# EAGLE design ArduinoAirQuailtyTop (EAGLE 7.4.0)
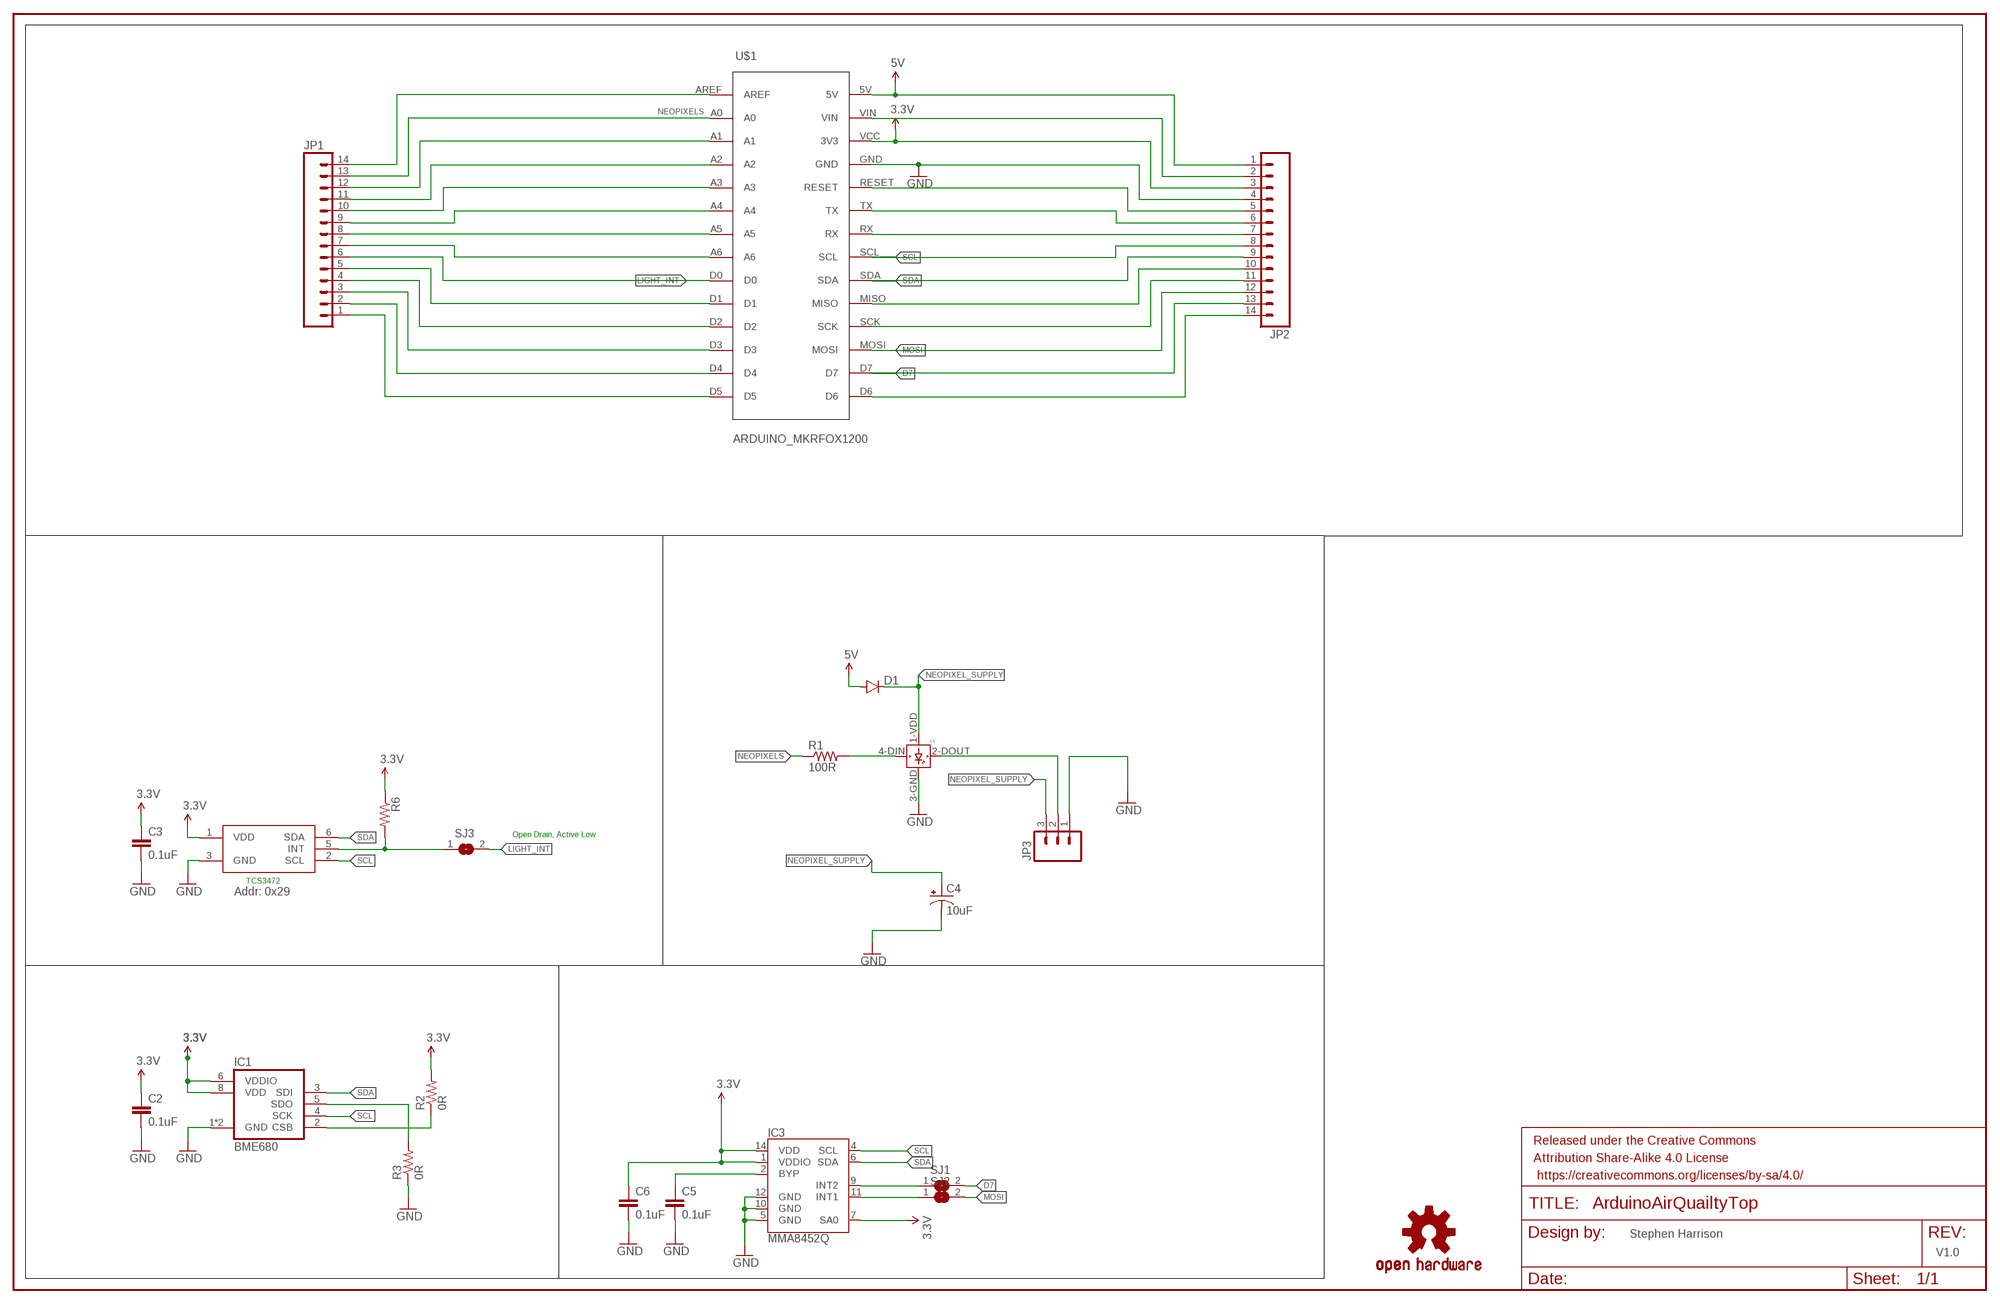
[diagram p0: schematic, sheet 1]

## Parts
C2  0.1uF  CAP0805  [0805]
C3  0.1uF  CAP0805  [0805]
C4  10uF  10UF-16V-10%(TANT)  [EIA3216]
C5  0.1uF  CAP0805  [0805]
C6  0.1uF  CAP0805  [0805]
D1  DIODESMA  [SMA-DIODE]
FRAME1  FRAME-LEDGER  [CREATIVE_COMMONS]
IC1  BME680  [BME680]
IC2  TCS34725FN  TCS3472  [FN-6]
IC3  MMA8452Q  [QFN-16_0.5MM]
JP1  M14  [1X14]
JP2  M14  [1X14]
JP3  M03POLAR  [MOLEX-1X3]
L1  WS2812B  [WS2812B]
LOGO1  OSHW-LOGOM  [OSHW-LOGO-M]
R1  100R  RESISTOR0805-RES  [0805]
R2  0R  RESISTOR0805-RES  [0805]
R3  0R  RESISTOR0805-RES  [0805]
R6  RESISTOR0805-RES  [0805]
SJ1  SJ  [SJ]
SJ2  SJ  [SJ]
SJ3  SJ  [SJ]
U$1  ARDUINO_MKRFOX1200  [ARDUINO_MKRFOX1200]

## Nets
3.3V: C2.1 C3.1 C6.1 IC1.6(VDDIO) IC1.8(VDD) IC2.1(VDD) IC3.1(VDDIO) IC3.7(SA0) IC3.14(VDD) JP2.3 R2.2 R6.1 U$1.VCC(3V3)
5V: D1.A JP2.1 U$1.5V
D7: JP2.13 SJ1.2 U$1.D7
GND: C2.2 C3.2 C4.C(-) C5.2 C6.2 IC1.1(GND) IC1.7(GND) IC2.3(GND) IC3.5(GND) IC3.10(GND) IC3.12(GND) JP2.4 JP3.1 L1.3-GND(GND) R3.1 U$1.GND
LIGHT_INT: JP1.6 SJ3.2 U$1.D0
MOSI: JP2.12 SJ2.2 U$1.MOSI
N$3: IC3.9(INT2) SJ1.1
N$4: IC3.11(INT1) SJ2.1
N$5: JP1.1 U$1.D5
N$6: JP1.2 U$1.D4
N$7: JP1.3 U$1.D3
N$8: C5.1 IC3.2(BYP)
N$9: JP1.4 U$1.D2
N$10: JP1.5 U$1.D1
N$11: JP1.7 U$1.A6
N$12: JP1.8 U$1.A5
N$13: JP1.9 U$1.A4
N$14: JP1.10 U$1.A3
N$15: JP1.11 U$1.A2
N$16: JP1.12 U$1.A1
N$18: JP1.14 U$1.AREF
N$19: JP2.14 U$1.D6
N$21: JP2.11 U$1.SCK
N$22: JP2.10 U$1.MISO
N$24: JP2.7 U$1.RX
N$25: JP2.6 U$1.TX
N$26: JP2.5 U$1.RESET
N$27: JP2.2 U$1.VIN
N$35: IC1.5(SDO) R3.2
N$37: IC1.2(CSB) R2.1
N$40: IC2.5(INT) R6.2 SJ3.1
N$42: L1.4-DIN(DIN) R1.2
N$43: JP3.2 L1.2-DOUT(DOUT)
NEOPIXEL_SUPPLY: C4.A(+) D1.C JP3.3 L1.1-VDD(VDD)
NEOPIXELS: JP1.13 R1.1 U$1.A0
SCL: IC1.4(SCK) IC2.2(SCL) IC3.4(SCL) JP2.8 U$1.SCL
SDA: IC1.3(SDI) IC2.6(SDA) IC3.6(SDA) JP2.9 U$1.SDA

## Notes on the sheet
- Open Drain, Active Low
- TCS3472
- Addr: 0x29
- Stephen Harrison
- V1.0

## Library data of the parts
C2 C3 C5 C6 = SparkFun-Capacitors:CAP: Capacitor Standard 0603 ceramic capacitor, and 0.1" leaded capacitor.
C4 = SparkFun-Capacitors:10UF-16V-10%(TANT): CAP-00811 1206/EIA-3216 Tantalum capacitor; PROD_ID: CAP-00811
D1 = SparkFun-DiscreteSemi:DIODE: Diode These are standard reverse protection diodes and small signal diodes. SMA package can handle up to about 1A. SOD-323 can handle about 200mA. What the SOD-323 package when ordering, there are some mfgs out there that are 5-pin packages.
FRAME1 = SparkFun-Aesthetics:FRAME-LEDGER: Schematic Frame Standard 11x14 US Ledger frame
IC1 = bosch-bme680:BME680: BME680 integrates for the first time individual high linearity and high accuracy sensors for gas, pressure, humidity and temperature. The library has been designed by Richard Magdycz <https://www.facebook.com/groups/eaglecadsoftUK>; MOUSER: 262-BME680
IC2 = TCS3472:TCS3472; MOUSER: 985-TCS34725FN
IC3 = SparkFun-Sensors:MMA8452Q: MMA8452Q 3-Axis, 12/8-bit Digital Accelerometer Supply Voltage: 1.6-3.6V Range: +/- 2g, 4g, 8g Interface: I2C, 12-bit and 8-bit ODR: 1.56 Hz - 800 Hz Package: QFN-16 http://cache.freescale.com/files/sensors/doc/data_sheet/MMA8452Q.pdf; MOUSER: 841-MMA8452QT; PROD_ID: IC-10769
JP1 JP2 = SparkFun-Connectors:M14: Header 14 Standard 14-pin 0.1" header. Use with straight break away headers (SKU : PRT-00116), right angle break away headers (PRT-00553), swiss pins (PRT-00743), machine pins (PRT-00117), and female headers (PRT-00115).
JP3 = SparkFun-Connectors:M03: Header 3 Standard 3-pin 0.1" header. Use with straight break away headers (SKU : PRT-00116), right angle break away headers (PRT-00553), swiss pins (PRT-00743), machine pins (PRT-00117), and female headers (PRT-00115). Molex polarized connector foot print use with SKU : PRT-08232 with associated crimp pins and housings.
L1 = adafruit:WS2812B
LOGO1 = SparkFun-Aesthetics:OSHW-LOGO: Open Source Hardware Logo This logo indicates the piece of hardware it is found on incorporates a OSHW license and/or adheres to the definition of open source hardware found here: http://freedomdefined.org/OSHW
R1-R3 R6 = SparkFun-Resistors:RESISTOR: Resistor Basic schematic elements and footprints for 0603, 1206, and PTH resistors.
SJ1-SJ3 = jumper:SJ: SMD solder JUMPER
U$1 = Arduino:ARDUINO_MKRFOX1200

## Board
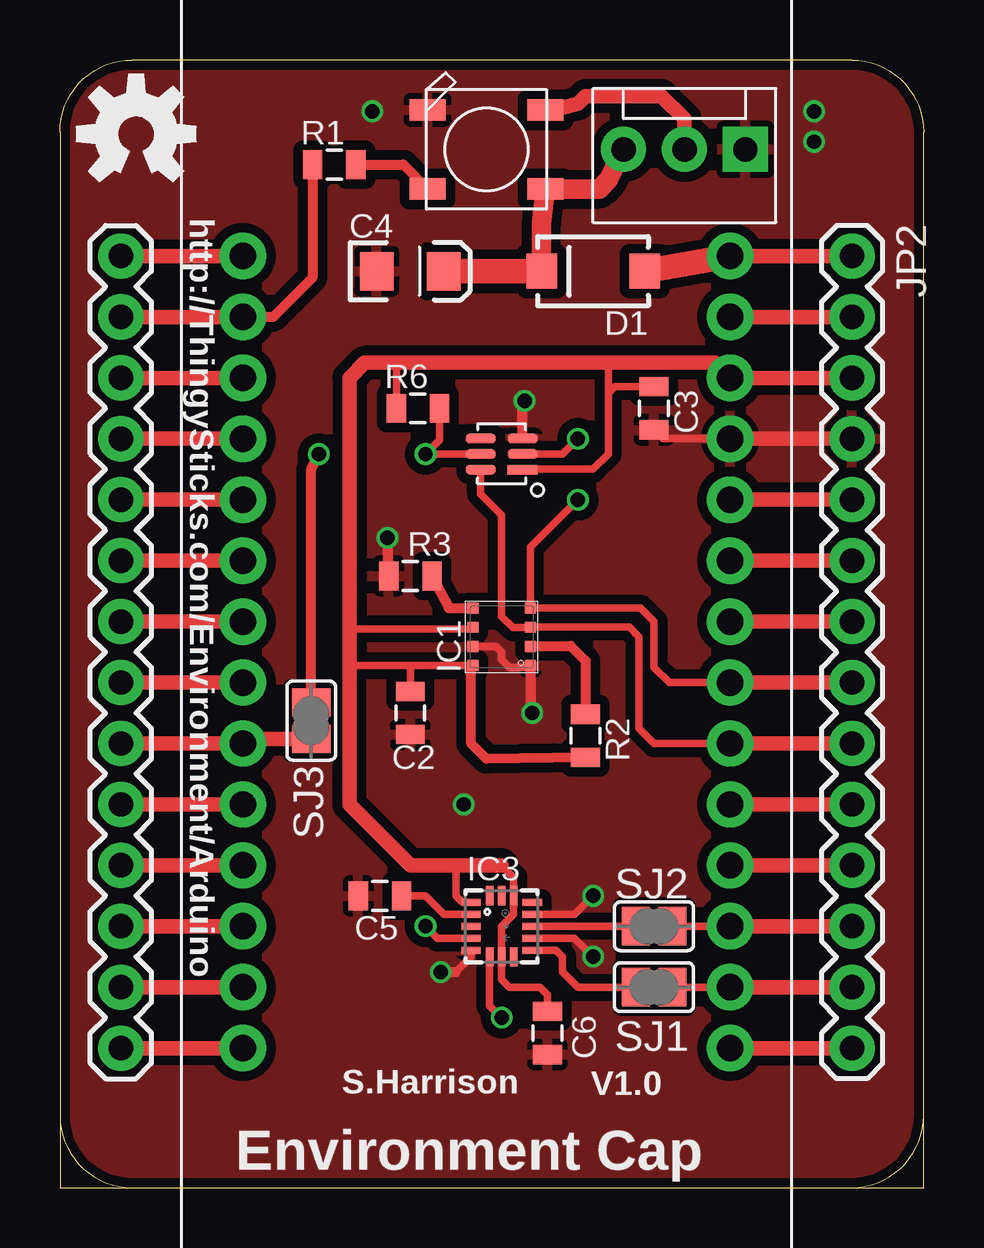
[diagram p1: board, top side]
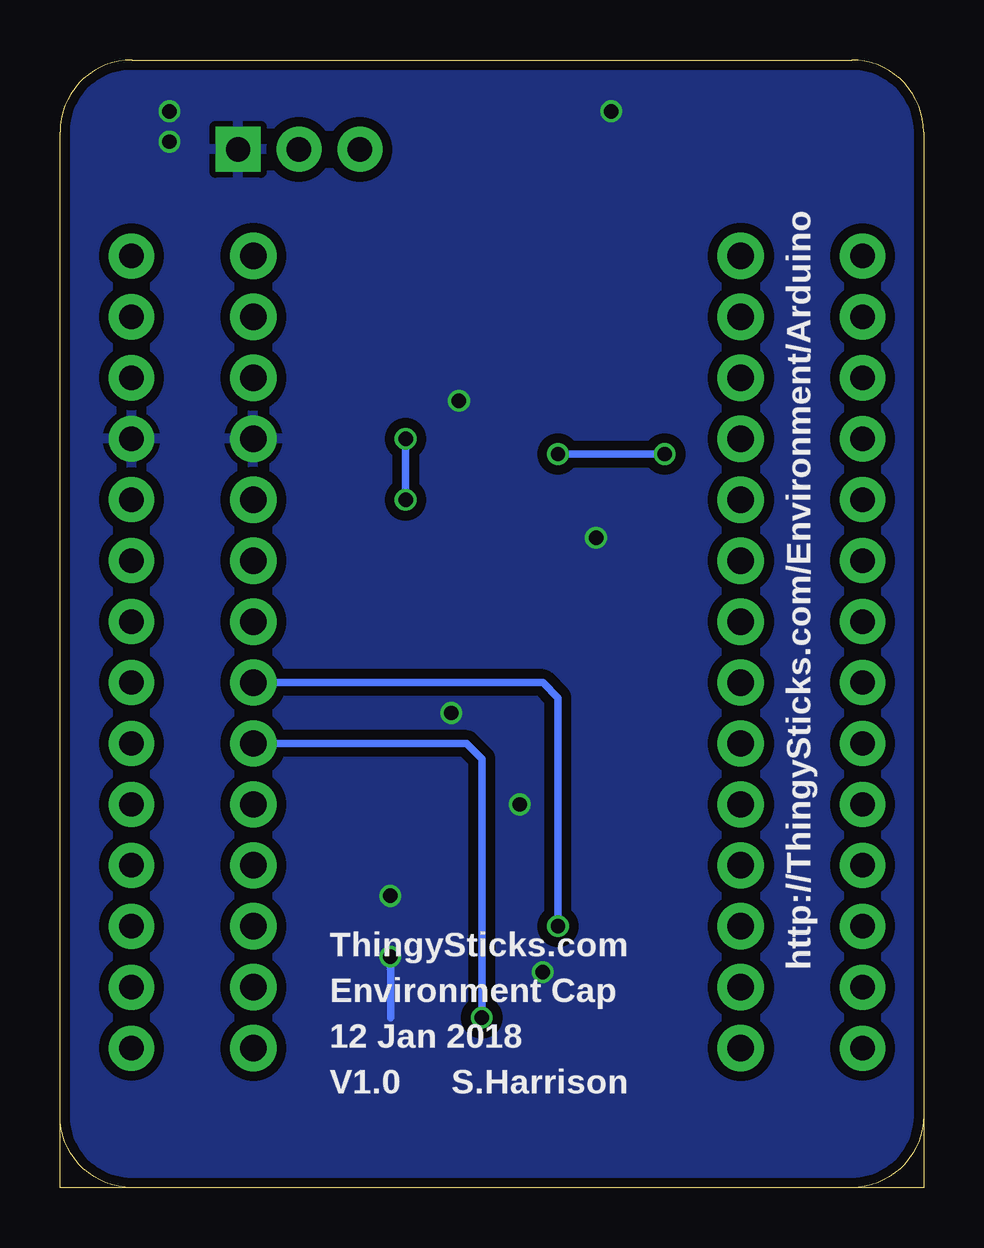
[diagram p2: board, bottom side, seen from below]

Size 36 x 47 mm. Coordinates in mm from the lower left corner, seen from the top.
Outline: 3,0 0,0 0,3
Outline: 3,0 33,0
Outline: 33,0 36,0 36,3
Outline: 36,3 36,44 arc90 33,47 3,47 arc90 0,44 0,3
Outline: 0,3 arc90 3,0
Outline: 33,0 arc90 36,3
Copper layers (1*16): Top 0.035mm / dielectric 1.5mm / Bottom 0.035mm
Design rules "dirt_cheap_dirty_boards.v1": minimum track width 5mil, minimum drill 12mil, track to track 5mil, track to pad 5mil, pad to pad 5mil, via to via 5mil, smd to smd 0mil, copper to edge 10mil, drill to drill 10mil, minimum pad ring 10mil, minimum via ring 6mil, stop-mask expansion 2mil, vias tented up to drill 25mil, thermal gap 10mil

### Footprints (pad centres in the part's own frame; a part is rotated, then mirrored left to right if it is on the bottom)
0805 = smd 0.8 x 1.2: 1 -0.9,0; 2 0.9,0
EIA3216 = smd 1.4 x 1.6: A 1.4,0; C -1.4,0
SMA-DIODE = smd 1.27 x 1.47: A -2.15,0; C 2.15,0
BME680 = smd 0.45 x 0.45: 1 -1.2,-1.2; 2 -0.4,-1.2; 3 0.4,-1.2; 4 1.2,-1.2; 5 1.2,1.2; 6 0.4,1.2; 7 -0.4,1.2; 8 -1.2,1.2
FN-6 = smd 1.25 x 0.4: 1 -0.875,0.65; 2 -0.875,0; 3 -0.875,-0.65; 4 0.875,-0.65; 5 0.875,0; 6 0.875,0.65
QFN-16_0.5MM = smd 0.8 x 0.3: 1 -1.275,1; 2 -1.275,0.5; 3 -1.275,0; 4 -1.275,-0.5; 5 -1.275,-1; 9 1.275,-1; 10 1.275,-0.5; 11 1.275,0; 12 1.275,0.5; 13 1.275,1 | smd 0.3 x 0.8: 6 -0.5,-1.275; 7 0,-1.275; 8 0.5,-1.275; 14 0.5,1.275; 15 0,1.275; 16 -0.5,1.275
1X14 = drill 1.016 pad 1.88: 1 0,0; 2 2.54,0; 3 5.08,0; 4 7.62,0; 5 10.16,0; 6 12.7,0; 7 15.24,0; 8 17.78,0; 9 20.32,0; 10 22.86,0; 11 25.4,0; 12 27.94,0; 13 30.48,0; 14 33.02,0
MOLEX-1X3 = drill 1.016 pad 1.88 square: 1 0,0 | drill 1.016 pad 1.88: 2 2.54,0; 3 5.08,0
WS2812B = smd 1.5 x 0.9: 1-VDD 2.45,-1.65; 2-DOUT 2.45,1.65; 3-GND -2.45,1.65; 4-DIN -2.45,-1.65
SJ = smd 1.168 x 1.6: 1 -0.762,0; 2 0.762,0
ARDUINO_MKRFOX1200 = drill 1.1 pad 1.93: 5V 22.86,45.72; A0 2.54,43.18; A1 2.54,40.64; A2 2.54,38.1; A3 2.54,35.56; A4 2.54,33.02; A5 2.54,30.48; A6 2.54,27.94; AREF 2.54,45.72; D0 2.54,25.4; D1 2.54,22.86; D2 2.54,20.32; D3 2.54,17.78; D4 2.54,15.24; D5 2.54,12.7; D6 22.86,12.7; D7 22.86,15.24; GND 22.86,38.1; MISO 22.86,22.86; MOSI 22.86,17.78; RESET 22.86,35.56; RX 22.86,30.48; SCK 22.86,20.32; SCL 22.86,27.94; SDA 22.86,25.4; TX 22.86,33.02; VCC 22.86,40.64; VIN 22.86,43.18

### Placement (x,y rotation side)
C2  14.61,19.78 270 top
C3  24.77,32.48 270 top
C4  14.61,38.2 0 top
C5  13.34,12.16 180 top
C6  20.32,6.45 270 top
D1  22.23,38.2 180 top
FRAME1  -3.17,-16.41 0 top  (outside the outline)
IC1  18.41,22.95 90 top
IC2  18.41,30.57 180 top
IC3  18.41,10.89 0 top
JP1  2.54,5.81 90 top
JP2  33.02,38.83 270 top
JP3  28.57,43.27 180 top
L1  17.78,43.27 0 top
LOGO1  3.17,43.91 0 top
R1  11.43,42.64 0 top
R2  21.91,18.83 270 top
R3  14.61,25.5 0 top
R6  14.92,32.48 0 top
SJ1  24.77,8.35 0 top
SJ2  24.77,10.89 0 top
SJ3  10.48,19.46 270 top
U$1  5.08,-6.89 0 top

### Tracks (layer width: path | path; a pad name or v marks a point on that pad's centre or on a via)
3.3V
  Top 0.305: 12.06,21.68 12.13,21.75 14.61,21.75 | 14.61,21.75 IC1.8 | IC1.6 16.98,23.27 12.06,23.27 | C2.1 14.61,21.75 | IC2.1 19.3,29.94 22.23,29.94 22.86,30.57 22.86,33.11 | 22.86,33.11 22.86,34.38 | 18.41,13.43 18.91,12.93 IC3.14 18.91,11.39 18.41,10.89 IC3.7 18.41,8.67 18.73,8.35 20,8.35 20.32,8.03 C6.1 | IC3.1 16.78,11.89 16.51,12.16 16.51,13.43 | 12.12,28.72 12.06,28.67 | R6.1 14.02,34.33 13.97,34.38 | C3.1 23.12,33.38 22.86,33.11
  Top 0.406: R2.2 17.78,17.88 17.14,18.51 17.14,21.68 IC1.8
  Top 0.61: 18.41,13.43 16.51,13.43 14.61,13.43 12.06,15.97 12.06,21.68 12.06,23.27 12.06,28.67 12.06,33.75 12.7,34.38 13.97,34.38 22.86,34.38 27.3,34.38 U$1.VCC JP2.3
5V
  Top 0.61: JP2.1 U$1.5V
  Top 1.016: D1.A U$1.5V
D7
  Top 0.305: U$1.D7 SJ1.2 24.13,8.35
  Top 0.61: JP2.13 U$1.D7
GND  (via drill 0.6)
  Top 0.305: IC3.5 17.14,9.62 16.51,8.98 | IC3.10 21.45,10.39 v22.23,9.62 | IC3.12 21.45,11.39 v22.23,12.16 | U$1.GND 25.14,31.21 C3.2 | IC1.7 18.18,22.55 18.41,22.32 18.41,22 18.73,21.68 19.55,21.68 IC1.1
  Top 0.406: IC1.1 19.61,19.85 v19.68,19.78 | v13.65,27.08 13.65,25.55 R3.1 | v15.88,8.98 16.51,8.98 | IC2.3 19.29,32.72 v19.37,32.8
  Top 0.61: U$1.GND JP2.4
  Bottom 0.305: v22.23,9.62 22.23,7.08
  other vias: 13.02,44.86 31.43,44.86 31.43,43.59 16.83,15.97
  pour Bottom (isolate 0.406, rank 6): -0.3,-0.4 -0.5,47.59 36.3,47.38 36.3,-0.4
  pour Top (isolate 0.406, rank 6): 0,47.72 36.83,47.09 36.83,-0.54 -0.64,-0.54
LIGHT_INT
  Top 0.61: SJ3.2 7.75,18.7 U$1.D0 JP1.6
MOSI
  Top 0.305: SJ2.2 U$1.MOSI
  Top 0.61: U$1.MOSI JP2.12
N$1
  Top 0.305: 10.48,20.1 10.48,18.51
N$3
  Top 0.305: IC3.9 20.68,9.89 20.95,9.62 20.95,8.98 21.59,8.35 SJ1.1
N$4
  Top 0.305: SJ2.1 IC3.11
N$5
  Top 0.61: U$1.D5 JP1.1
N$6
  Top 0.61: JP1.2 U$1.D4
N$7
  Top 0.61: U$1.D3 JP1.3
N$8
  Top 0.305: IC3.2 16.01,11.39 15.24,12.16 C5.1
N$9
  Top 0.61: JP1.4 U$1.D2
N$10
  Top 0.61: U$1.D1 JP1.5
N$11
  Top 0.61: JP1.7 U$1.A6
N$12
  Top 0.61: U$1.A5 JP1.8
N$13
  Top 0.61: U$1.A4 JP1.9
N$14
  Top 0.61: JP1.10 U$1.A3
N$15
  Top 0.61: U$1.A2 JP1.11
N$16
  Top 0.61: JP1.12 U$1.A1
N$18
  Top 0.61: JP1.14 U$1.AREF
N$19
  Top 0.61: U$1.D6 JP2.14
N$21
  Top 0.61: JP2.11 U$1.SCK
N$22
  Top 0.61: U$1.MISO JP2.10
N$24
  Top 0.61: JP2.7 U$1.RX
N$25
  Top 0.61: U$1.TX JP2.6
N$26
  Top 0.61: JP2.5 U$1.RESET
N$27
  Top 0.61: U$1.VIN JP2.2
N$35
  Top 0.406: R3.2 16.21,24.16 IC1.5
N$37
  Top 0.406: IC1.2 19.63,22.57 21.29,22.57 21.91,21.95 R2.1
N$40  (via drill 0.6)
  Top 0.305: IC2.5 v15.24,30.57 15.82,31.16 R6.2
  Top 0.406: SJ3.1 10.48,29.94 v10.79,30.57
  Bottom 0.305: v15.24,30.57 v10.79,30.57
N$42
  Top 0.406: R1.2 14.31,42.64 L1.4-DIN
N$43
  Top 0.61: JP3.2 26.04,44.55 25.08,45.5 21.91,45.5 21.59,45.18 20.95,45.02 L1.2-DOUT
NEOPIXEL_SUPPLY
  Top 0.813: JP3.3 22.86,42.01 22.48,41.62 L1.1-VDD 20.07,40.2 D1.C
  Top 1.016: C4.A D1.C
NEOPIXELS
  Top 0.406: R1.1 10.53,37.93 8.89,36.29 U$1.A0
  Top 0.61: U$1.A0 JP1.13
SCL  (via drill 0.6)
  Top 0.305: IC3.4 15.74,10.39 v15.24,10.89 | IC2.2 20.95,30.57 v21.59,31.21 | v21.59,28.67 19.61,26.7 IC1.4 24.2,24.16 24.77,23.59 24.77,21.68 25.4,21.05 U$1.SCL
  Top 0.61: U$1.SCL JP2.8
  Bottom 0.305: v15.24,10.89 15.24,20.41 15.88,21.05 U$1.SCL | v21.59,31.21 v21.59,28.67
SDA  (via drill 0.6)
  Top 0.305: IC2.6 17.54,28.91 18.41,28.04 18.41,23.81 18.89,23.34 19.6,23.34 IC1.3 23.73,23.36 24.13,22.95 24.13,19.14 24.77,18.51 27.3,18.51 U$1.SDA | IC3.6 17.91,7.58 v18.41,7.08
  Top 0.61: JP2.9 27.3,18.51
  Bottom 0.305: v18.41,7.08 18.41,17.88 19.05,18.51 U$1.SDA

### Text on the board
tNames: http://ThingySticks.com/Environment/Arduino | V1.0 | S.Harrison | Environment Cap
bNames: http://ThingySticks.com/Environment/Arduino | ThingySticks.com | Environment Cap | 12 Jan 2018 | S.Harrison | V1.0